# EAGLE design v0.1 (EAGLE 7.1.0)
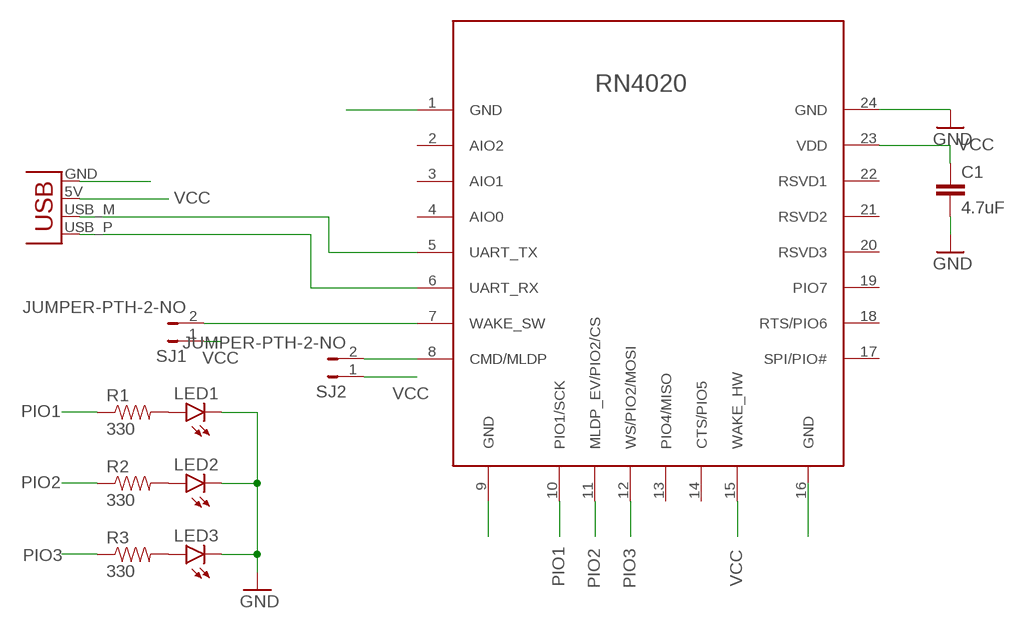
[diagram p0: schematic, sheet 1]

## Parts
C1  4.7uF  CAP1206  [1206]
JP1  USBPCB  [USB-A-PCB]
LED1  LED1206  [LED-1206]
LED2  LED1206  [LED-1206]
LED3  LED1206  [LED-1206]
R1  330  RESISTOR0603-RES  [0603-RES]
R2  330  RESISTOR0603-RES  [0603-RES]
R3  330  RESISTOR0603-RES  [0603-RES]
SJ1  JUMPER-PTH-2-NO  [PTH-JUMPER-2-NO_NO_SILK]
SJ2  JUMPER-PTH-2-NO  [PTH-JUMPER-2-NO_NO_SILK]
U$1  RN4020  [RN4020]

## Nets
GND: C1.2 JP1.GND LED1.C LED2.C LED3.C U$1.1(GND) U$1.9(GND) U$1.24(GND)
N$1: LED1.A R1.2
N$2: JP1.USB_M(D-) U$1.5(UART_TX)
N$3: JP1.USB_P(D+) U$1.6(UART_RX)
N$4: SJ2.2 U$1.8(CMD/MLDP)
N$7: LED2.A R2.2
N$8: LED3.A R3.2
N$9: SJ1.2 U$1.7(WAKE_SW)
PIO1: R1.1 U$1.10(PIO1/SCK)
PIO2: R2.1 U$1.11(MLDP_EV/PIO2/CS)
PIO3: R3.1 U$1.12(WS/PIO2/MOSI)
VCC: C1.1 JP1.5V(VBUS) SJ1.1 SJ2.1 U$1.15(WAKE_HW) U$1.23(VDD)
Unconnected: U$1.2(AIO2) U$1.3(AIO1) U$1.4(AIO0) U$1.13(PIO4/MISO) U$1.14(CTS/PIO5) U$1.17(SPI/PIO#) U$1.18(RTS/PIO6) U$1.19(PIO7) U$1.20(RSVD3) U$1.21(RSVD2) U$1.22(RSVD1)

## Power pins joined to a net without a drawn wire
GND: U$1.16(GND)

## Library data of the parts
C1 = SparkFun-Capacitors:CAP: Capacitor Standard 0603 ceramic capacitor, and 0.1" leaded capacitor.
JP1 = SparkFun-Connectors:USB: USB Connectors USB-B-PTH is fully proven SKU : PRT-00139/CONN-08278 USB-miniB is fully proven SKU : PRT-00587 USB-A-PCB is untested. USB-A-H is throughly reviewed, but untested. Spark Fun Electronics SKU : PRT-00437 USB-B-SMT is throughly reviewed, but untested. Needs silkscreen touching up. USB-A-S has not been used/tested USB-MB-H has not been used/tested USB-MICROB has been used. CONN-09505
LED1-LED3 = SparkFun-LED:LED: LEDs Standard schematic elements and footprints for 5mm, 3mm, 1206, and 0603 sized LEDs. 5mm - Spark Fun Electronics SKU : COM-00529 (and others)
R1-R3 = SparkFun-Passives:RESISTOR: Resistor Basic schematic elements and footprints for 0603, 1206, and PTH resistors.
SJ1 SJ2 = SparkFun-Passives:JUMPER-PTH-2-NO
U$1 = microchip:RN4020

## Board
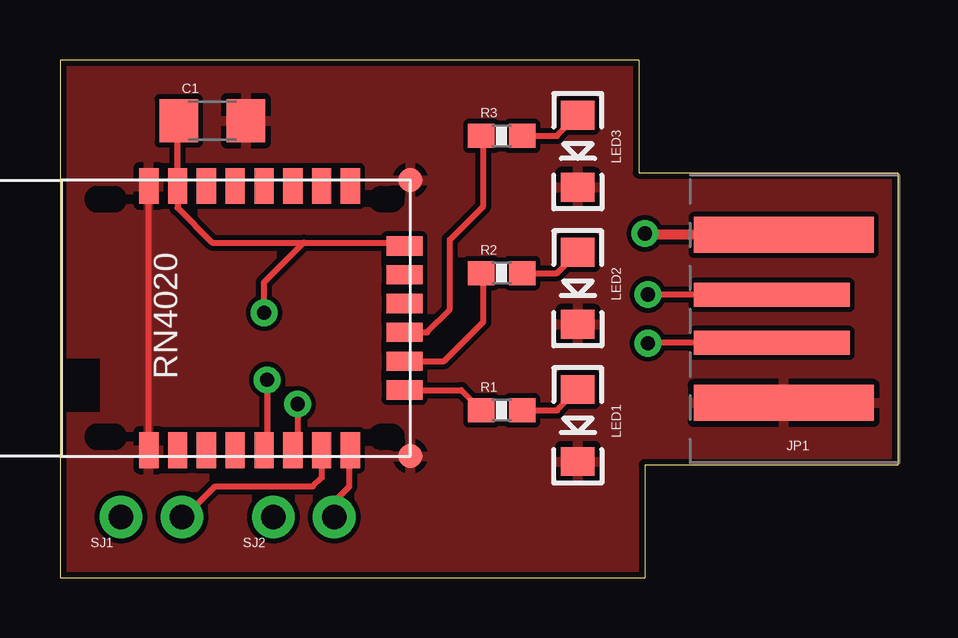
[diagram p1: board, top side]
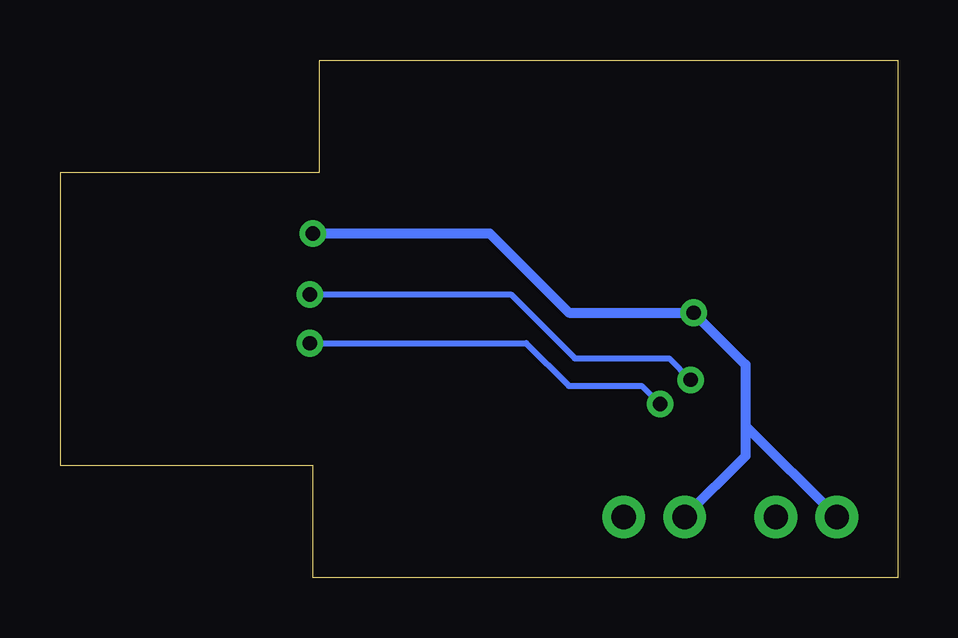
[diagram p2: board, bottom side, seen from below]

Size 34.92 x 21.58 mm. Coordinates in mm from the lower left corner, seen from the top.
Outline: 0,0 24.38,0 24.38,4.7 34.92,4.7 34.92,16.89 24.13,16.89 24.13,21.58 0,21.58 0,0
Copper layers (1*16): Top 0.035mm / dielectric 1.5mm / Bottom 0.035mm
Design rules "SparkFun": minimum track width 8mil, minimum drill 20mil, track to track 8mil, track to pad 8mil, pad to pad 8mil, via to via 8mil, smd to smd 8mil, copper to edge 10mil, drill to drill 8mil, minimum pad ring 12mil, minimum via ring 10mil, stop-mask expansion 4mil, vias tented up to drill 25mil, thermal gap 10mil

### Footprints (pad centres in the part's own frame; a part is rotated, then mirrored left to right if it is on the bottom)
1206 = smd 1.6 x 1.8: 1 -1.4,0; 2 1.4,0
USB-A-PCB = smd 7.5 x 1.5: 5V -0.2,-3.5; GND -0.2,3.5 | smd 6.5 x 1: USB_M 0.3,-1; USB_P 0.3,1
LED-1206 = smd 1.2 x 1.4: A -1.5,0; C 1.5,0
0603-RES = smd 1.1 x 1: 1 -0.85,0; 2 0.85,0
PTH-JUMPER-2-NO_NO_SILK = drill 1.016 pad 1.778: 1 -1.27,0; 2 1.27,0
RN4020 = smd 1.5 x 0.8: 1 0.25,10.9; 2 0.25,9.7; 3 0.25,8.5; 4 0.25,7.3; 5 0.25,6.1; 6 0.25,4.9; 7 0.25,3.7; 8 0.25,2.5; 17 11.25,2.5; 18 11.25,3.7; 19 11.25,4.9; 20 11.25,6.1; 21 11.25,7.3; 22 11.25,8.5; 23 11.25,9.7; 24 11.25,10.9 | smd 1 x 1: 9 0,0; 16 11.5,0 | smd 0.8 x 1.5: 10 2.75,0.25; 11 3.95,0.25; 12 5.15,0.25; 13 6.35,0.25; 14 7.55,0.25; 15 8.75,0.25

### Placement (x,y rotation side)
C1  6.35,19.05 0 top
JP1  29.97,10.79 180 top
LED1  21.59,6.35 270 top
LED2  21.59,12.06 270 top
LED3  21.59,17.78 270 top
R1  18.41,6.99 0 top
R2  18.41,12.7 0 top
R3  18.41,18.41 0 top
SJ1  3.81,2.54 0 top
SJ2  10.16,2.54 0 top
U$1  14.61,5.08 90 top

### Tracks (layer width: path | path; a pad name or v marks a point on that pad's centre or on a via)
GND
  Top 0.254: U$1.1 U$1.24
  pour Top: 0,0 24.38,0 24.38,4.7 34.92,4.7 34.92,16.89 24.13,16.89 24.13,21.59 0,21.59
N$1
  Top 0.254: R1.2 20.73,6.99 LED1.A
N$2  (via drill 0.6)
  Top 0.254: JP1.USB_M 24.53,11.79 v24.51,11.81 | v8.64,8.26 8.64,5.46 U$1.5
  Bottom 0.254: v24.51,11.81 16.13,11.81 13.46,9.14 9.53,9.14 v8.64,8.26
N$3  (via drill 0.6)
  Top 0.254: JP1.USB_P 24.53,9.79 v24.51,9.78 | v9.91,7.24 9.91,5.53 U$1.6
  Bottom 0.254: v24.51,9.78 15.49,9.78 13.72,8 10.67,8 v9.91,7.24
N$4
  Top 0.254: SJ2.2 11.43,3.17 12.06,3.81 12.06,5.29 U$1.8
N$7
  Top 0.254: R2.2 20.73,12.7 LED2.A
N$8
  Top 0.254: R3.2 20.73,18.41 LED3.A
N$9
  Top 0.254: SJ1.2 5.21,2.54 6.48,3.81 10.54,3.81 10.92,4.19 10.92,5.31 U$1.7
PIO1
  Top 0.254: U$1.10 16.72,7.83 R1.1
PIO2
  Top 0.254: U$1.11 16.02,9.03 17.65,10.67 17.65,12.61 R2.1
PIO3
  Top 0.254: U$1.12 15.31,10.23 16.26,11.18 16.26,14.1 17.65,15.49 17.65,18.33 R3.1
VCC  (via drill 0.6)
  Top 0.254: C1.1 4.91,19 U$1.23 4.91,15.41 6.35,13.97 10.16,13.97 | 10.16,13.97 14.21,13.97 U$1.15 | v8.51,11.05 8.51,12.32 10.16,13.97
  Top 0.406: JP1.5V 24.44,14.29 v24.38,14.35
  Bottom 0.406: v24.38,14.35 17.02,14.35 13.72,11.05 v8.51,11.05 6.35,8.89 6.35,6.35 | 6.35,6.35 SJ1.1 | 6.35,6.35 6.35,5.08 SJ2.1